# Altium schematic sheet RFM232_V03.SchDoc
size 420 x 297 mm; Scale: {Масш.}; Title1str: {Наименование}; PageSetup: Record=PageOptions|CenterHorizontal=False|CenterVertical=False|PrintScale=0.95|XCorrection=0.00|YCorrection=0.00|PrintKind=1|BorderSize=5000000|LeftOffset=0|BottomOffset=0|Orientation=1|PaperLength=1000|PaperWidth=1000|Scale=100|PaperSource=15|PrintQuality=600|MediaType=1|DitherType=10|PaperKind=A4|PrintScaleMode=1; Title2str: {Наименование}; ProcessInspection: {Т.контр.}; Mass: {Масса}; NormInspection: {Н.контр.}; EngineerName: {Инженер}; Letter1Column: {}; Letter2Column: {}; Letter3Column: {}; DocumentType: {Документ}; DocumentType1str: {Документ}; DocumentType2str: {Документ}
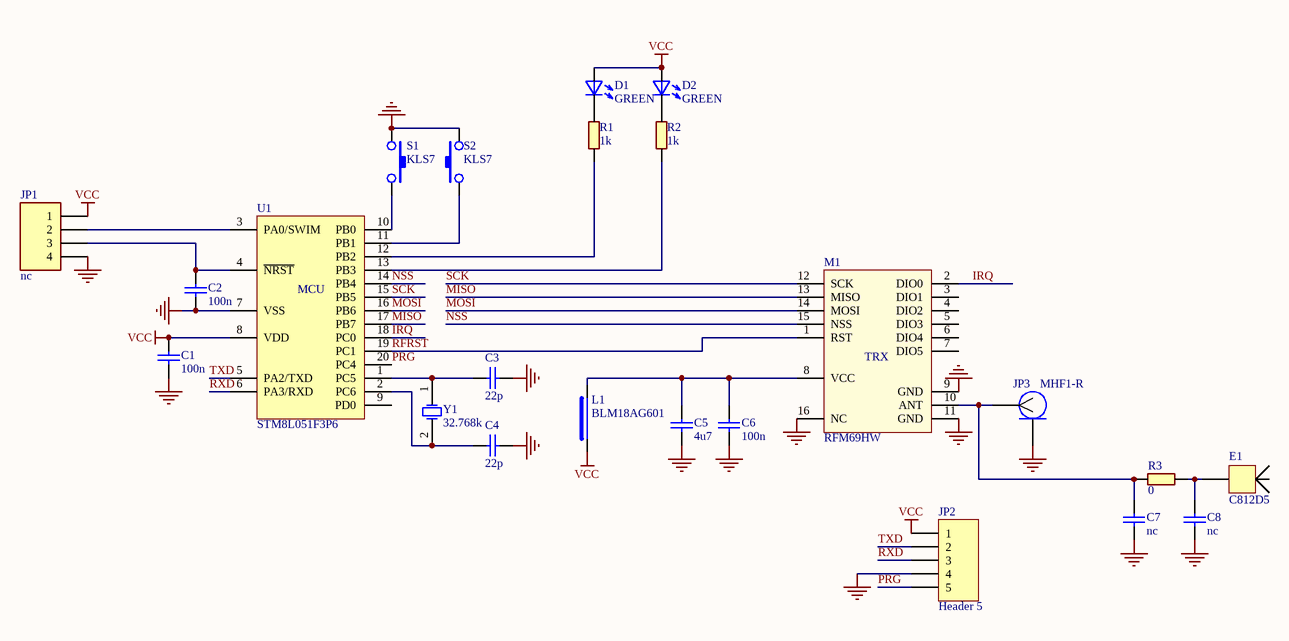
[diagram p0: RFM232_V03.SchDoc]

## Parts
C1  100n  [CAPC1608X08N]
C2  100n  [CAPC1608X08N]
C3  22p  [CAPC1608X08N]
C4  22p  [CAPC1608X08N]
C5  4u7  [CAPC2012X11N]
C6  100n  [CAPC1608X08N]
C7  nc  [CAPC1608X08N]
C8  nc  [CAPC1608X08N]
D1  GREEN  [LEDC200X125X80L40N]
D2  GREEN  [LEDC200X125X80L40N]
E1  C812D5  [C812D5]
JP1  nc  [HDRV4W70P254_4X1_889X254H754]
JP2  Header 5  [HDRV5W70P254_5X1_1143X254H754]
JP3  MHF1-R  [MHF1_R]
L1  BLM18AG601  [INDC1608X10N]
M1  RFM69HW  [LGA16_RFM69]
R1  1k  [RESC1608X06N]
R2  1k  [RESC1608X06N]
R3  0  [RESC1608X06N]
S1  KLS7  [KLS7-TS3602]
S2  KLS7  [KLS7-TS3602]
U1  STM8L051F3P6  [TSOP65P640X110-20N]
Y1  32.768k  [KX26]

## Nets
GND: C1.2 C2.2 C3.2 C4.2 C5.2 C6.2 C7.2 C8.2 JP1.4 JP2.4 JP3.2 M1.9(GND) M1.11(GND) M1.16(NC) S1.1 S2.2 U1.7(VSS)
VCC: C1.1 D1.A D2.A JP1.1 JP2.1 L1.1 U1.8(VDD)
IRQ: M1.2(DIO0) U1.18(PC0)
MISO: M1.13(MISO) U1.17(PB7)
MOSI: M1.14(MOSI) U1.16(PB6)
NSS: M1.15(NSS) U1.14(PB4)
PRG: JP2.5 U1.20(PC4)
RFRST: M1.1(RST) U1.19(PC1)
RXD: JP2.3 U1.6(PA3/RXD)
SCK: M1.12(SCK) U1.15(PB5)
TXD: JP2.2 U1.5(PA2/TXD)
NetC2_1: C2.1 JP1.3 U1.4(~{NRST})
NetC3_1: C3.1 U1.1(PC5) Y1.1(OSC1)
NetC4_1: C4.1 U1.2(PC6) Y1.2(OSC2)
NetC5_1: C5.1 C6.1 L1.2 M1.8(VCC)
NetC7_1: C7.1 JP3.1 M1.10(ANT) R3.1
NetC8_1: C8.1 E1.1(IN) R3.2
NetD1_K: D1.K R1.1
NetD2_K: D2.K R2.1
NetJP1_2: JP1.2 U1.3(PA0/SWIM)
NetR1_2: R1.2 U1.12(PB2)
NetR2_2: R2.2 U1.13(PB3)
NetS1_2: S1.2 U1.10(PB0)
NetS2_1: S2.1 U1.11(PB1)

Not connected (* = marked no-connect by the designer): M1 3(DIO1) 4(DIO2) 5(DIO3) 6(DIO4) 7(DIO5); U1 9(PD0)

## Notes on the sheet
- Перв. примен.
- Справ. №
- Подп. и дата
- Инв. № дубл.
- Взам. инв. №
- Изм.
- Лист
- № докум.
- Подп.
- Дата
- Лит.
- Масса
- Масштаб
- Т.контр.
- Пров.
- Разраб.
- Листов
- Инв. № подл.
- Н.контр.
- Утв.
- Копировал
- Формат А3
- (in symbol RFM69HW_V13_2) TRX
- (in symbol STM8L051F3P6) MCU

## Library data of the parts
C1-C8 = CAPN
D1 D2 = DLED
JP1 = HEADER 4: 4 Pin Header 2,0 mm, 1x04; Part Field 1: CviLux
JP2 = Header 5: Header, 5-Pin; LatestRevisionDate: 17-Jul-2002; LatestRevisionNote: Re-released for DXP Platform.; Publisher: Altium Limited
JP3 = MHF1
L1 = SUPRESOR: Примечание: *; Производитель: *
M1 = RFM69HW_V13_2
R1-R3 = RES
S1 S2 = SW-1: Вид: Кнопка; Производитель: *; Описание пользователя: *; *: *; Корпус: =Footprint; Тип: KLS7
Y1 = XTAL: Crystal Oscillator; Published: 8-Jun-2000; LatestRevisionDate: 17-Jul-2002; LatestRevisionNote: Re-released for DXP Platform.; PackageReference: R38; Publisher: Altium Limited; PackageDescription: Crystal, Thru-Hole; 2 Leads; Body 3.1 x 8.2 mm (Dia.xH)